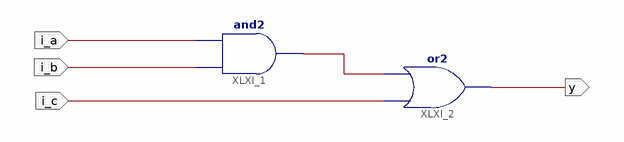
[diagram p0: schematic sheet 1]
// Xilinx ISE schematic funkcja.sch (spartan3e) as structural Verilog: 2 symbols, 4 ports
module funkcja (
  input  i_a,
  input  i_b,
  input  i_c,
  output y
);

  wire XLXN_1;

  and XLXI_1 (XLXN_1, i_b, i_a);
  or XLXI_2 (y, i_c, XLXN_1);
endmodule
